# Altium schematic sheet LPC.SchDoc
size 320 x 228 mm; DocumentNumber: 2; SheetNumber: 2; SheetTotal: 5
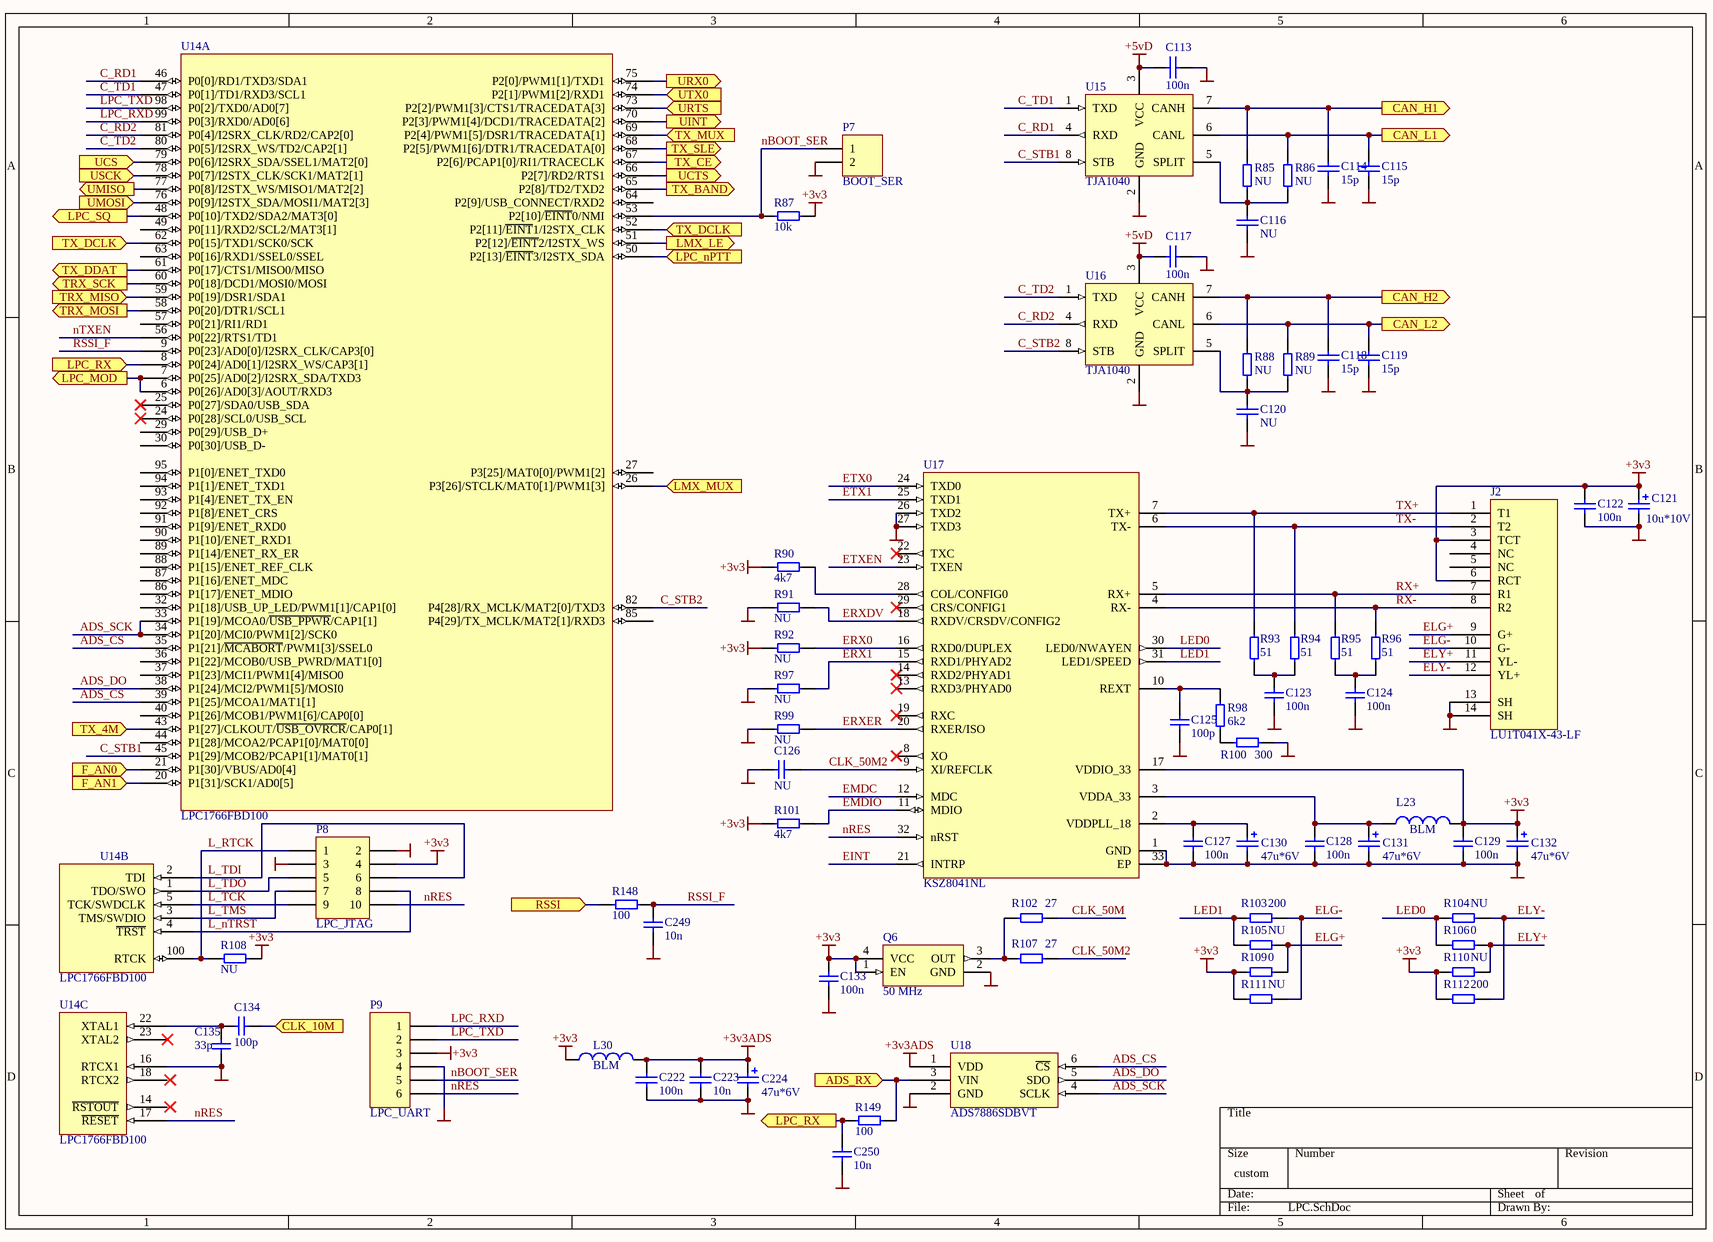
[diagram p0: LPC.SchDoc]

## Parts
C113  100n  [CAPC1608N]
C114  15p  [CAPC1608N]
C115  15p  [CAPC1608N]
C116  NU  [CAPC1608N]
C117  100n  [CAPC1608N]
C118  15p  [CAPC1608N]
C119  15p  [CAPC1608N]
C120  NU  [CAPC1608N]
C121  10u*10V  [Case_A]
C122  100n  [CAPC1608N]
C123  100n  [CAPC1608L]
C124  100n  [CAPC1608L]
C125  100p  [CAPC1608L]
C126  NU  [CAPC1608L]
C127  100n  [CAPC1608L]
C128  100n  [CAPC1608L]
C129  100n  [CAPC1608L]
C130  47u*6V  [Case_A]
C131  47u*6V  [Case_A]
C132  47u*6V  [Case_A]
C133  100n  [CAPC1608L]
C134  100p  [CAPC1608L]
C135  33p  [CAPC1608L]
C222  100n  [CAPC1608N]
C223  10n  [CAPC1608N]
C224  47u*6V  [Case_A]
C249  10n  [CAPC1608L]
C250  10n  [CAPC1608L]
J2  LU1T041X-43-LF  [JACK1.27-4H8C]
L23  BLM  [INDC2012L]
L30  BLM  [CAPC2012N]
P7  BOOT_SER  [HDR1X2]
P8  LPC_JTAG  [HDR2X5]
P9  LPC_UART  [HDR1X6]
Q6  50 MHz  [XTAL_7.5_5mm]
R85  NU  [RESC2012L]
R86  NU  [RESC2012L]
R87  10k  [RESC1608L]
R88  NU  [RESC2012L]
R89  NU  [RESC2012L]
R90  4k7  [RESC1608L]
R91  NU  [RESC1608L]
R92  NU  [RESC1608L]
R93  51  [RESC1608L]
R94  51  [RESC1608L]
R95  51  [RESC1608L]
R96  51  [RESC1608L]
R97  NU  [RESC1608L]
R98  6k2  [RESC1608L]
R99  NU  [RESC1608L]
R100  300  [RESC1608L]
R101  4k7  [RESC1608L]
R102  27  [RESC1608L]
R103  200  [RESC1608L]
R104  NU  [RESC1608L]
R105  NU  [RESC1608L]
R106  0  [RESC1608L]
R107  27  [RESC1608L]
R108  NU  [RESC1608L]
R109  0  [RESC1608L]
R110  NU  [RESC1608L]
R111  NU  [RESC1608L]
R112  200  [RESC1608L]
R148  100  [RESC1608L]
R149  100  [RESC1608L]
U14  LPC1766FBD100  [SOT407-1_L]  (parts A,B,C of 4)
U15  TJA1040  [SOIC-150-8]
U16  TJA1040  [SOIC-150-8]
U17  KSZ8041NL  [QFN50P500X500-32WAN]
U18  ADS7886SDBVT  [SOT26A-6N]

## Ports
ADS_RX (in), CAN_H1 (out), CAN_H2 (out), CAN_L1 (out), CAN_L2 (out), CLK_10M (in), F_AN0 (in), F_AN1 (in), LMX_LE (out), LMX_MUX (in), LPC_MOD (out), LPC_nPTT (in), LPC_RX (in), LPC_RX (out), LPC_SQ (out), RSSI (in), TRX_MISO (in), TRX_MOSI (out), TRX_SCK (out), TX_4M (in), TX_BAND (out), TX_CE (out), TX_DCLK (in), TX_DDAT (out), TX_MUX (in), TX_SLE (out), UCS (in), UCTS (out), UINT (out), UMISO (out), UMOSI (in), URTS (in), URX0 (out), USCK (in), UTX0 (in)

## Nets
+3v3: C121.1 C122.2 C129.2 C132.1 C133.2 J2.3(TCT) J2.6(RCT) L23.2 L30.1 P8.4 P9.3 Q6.1(EN) Q6.4(VCC) R87.2 R90.2 R92.2 R101.2 R108.1 R109.2 R110.2 R111.2 R112.2 U17.17(VDDIO_33)
+3v3ADS: C222.2 C223.2 C224.1 L30.2 U18.1(VDD)
+5vD: C113.1 C117.1 U15.3(VCC) U16.3(VCC)
GND: C113.2 C114.1 C115.1 C116.1 C117.2 C118.1 C119.1 C120.1 C121.2 C122.1 C123.1 C124.1 C125.1 C126.2 C127.1 C128.1 C129.1 C130.2 C131.2 C132.2 C133.1 C135.1 C222.1 C223.1 C224.2 C249.1 C250.1 J2.13(SH) J2.14(SH) P7.2 P8.2 P8.3 P9.4 Q6.2(GND) R91.2 R97.2 R99.2 R100.1 U14.16(RTCX1) U15.2(GND) U16.2(GND) U17.1(GND) U17.26(TXD2) U17.27(TXD3) U17.33(EP) U18.2(GND)
ADS_CS: U14.35(P1[21]/~{MCABORT}/PWM1[3]/SSEL0) U14.39(P1[25]/MCOA1/MAT1[1]) U18.6(~{CS})
ADS_DO: U14.38(P1[24]/MCI2/PWM1[5]/MOSI0) U18.5(SDO)
ADS_RX: R149.2 U18.3(VIN) ; port ADS_RX
ADS_SCK: U14.33(P1[19]/MCOA0/~{USB_PPWR}/CAP1[1]) U14.34(P1[20]/MCI0/PWM1[2]/SCK0) U18.4(SCLK)
C_RD1: U14.46(P0[0]/RD1/TXD3/SDA1) U15.4(RXD)
C_RD2: U14.81(P0[4]/I2SRX_CLK/RD2/CAP2[0]) U16.4(RXD)
C_STB1: U14.45(P1[29]/MCOB2/PCAP1[1]/MAT0[1]) U15.8(STB)
C_STB2: U14.82(P4[28]/RX_MCLK/MAT2[0]/TXD3) U16.8(STB)
C_TD1: U14.47(P0[1]/TD1/RXD3/SCL1) U15.1(TXD)
C_TD2: U14.80(P0[5]/I2SRX_WS/TD2/CAP2[1]) U16.1(TXD)
CAN_H1: C114.2 R85.1 U15.7(CANH) ; port CAN_H1
CAN_H2: C118.2 R88.1 U16.7(CANH) ; port CAN_H2
CAN_L1: C115.2 R86.1 U15.6(CANL) ; port CAN_L1
CAN_L2: C119.2 R89.1 U16.6(CANL) ; port CAN_L2
CLK_10M: C134.2 ; port CLK_10M
CLK_50M: R102.2
CLK_50M2: C126.1 R107.2 U17.9(XI/REFCLK)
EINT: U17.21(INTRP)
ELG+: J2.9(G+) R105.1 R109.1
ELG-: J2.10(G-) R103.1 R111.1
ELY+: J2.11(YL-) R106.1 R110.1
ELY-: J2.12(YL+) R104.1 R112.1
EMDC: U17.12(MDC)
EMDIO: R101.1 U17.11(MDIO)
ERX0: R92.1 U17.16(RXD0/DUPLEX)
ERX1: R97.1 U17.15(RXD1/PHYAD2)
ERXDV: R91.1 U17.18(RXDV/CRSDV/CONFIG2)
ERXER: R99.1 U17.20(RXER/ISO)
ETX0: U17.24(TXD0)
ETX1: U17.25(TXD1)
ETXEN: U17.23(TXEN)
F_AN0: U14.21(P1[30]/VBUS/AD0[4]) ; port F_AN0
F_AN1: U14.20(P1[31]/SCK1/AD0[5]) ; port F_AN1
L_nTRST: P8.8 U14.4(~{TRST})
L_RTCK: P8.1 R108.2 U14.100(RTCK)
L_TCK: P8.9 U14.5(TCK/SWDCLK)
L_TDI: P8.6 U14.2(TDI)
L_TDO: P8.5 U14.1(TDO/SWO)
L_TMS: P8.7 U14.3(TMS/SWDIO)
LED0: R104.2 R106.2 U17.30(LED0/NWAYEN)
LED1: R103.2 R105.2 U17.31(LED1/SPEED)
LMX_LE: U14.51(P2[12]/~{EINT}2/I2STX_WS) ; port LMX_LE
LMX_MUX: U14.26(P3[26]/STCLK/MAT0[1]/PWM1[3]) ; port LMX_MUX
LPC_MOD: U14.6(P0[26]/AD0[3]/AOUT/RXD3) U14.7(P0[25]/AD0[2]/I2SRX_SDA/TXD3) ; port LPC_MOD
LPC_nPTT: U14.50(P2[13]/~{EINT}3/I2STX_SDA) ; port LPC_nPTT
LPC_RX: C250.2 R149.1 U14.8(P0[24]/AD0[1]/I2SRX_WS/CAP3[1]) ; port LPC_RX
LPC_RXD: P9.1 U14.99(P0[3]/RXD0/AD0[6])
LPC_SQ: U14.48(P0[10]/TXD2/SDA2/MAT3[0]) ; port LPC_SQ
LPC_TXD: P9.2 U14.98(P0[2]/TXD0/AD0[7])
nBOOT_SER: P7.1 P9.5 R87.1 U14.53(P2[10]/~{EINT}0/NMI)
nRES: P8.10 P9.6 U14.17(~{RESET}) U17.32(nRST)
nTXEN: U14.56(P0[22]/RTS1/TD1)
RSSI: R148.1 ; port RSSI
RSSI_F: C249.2 R148.2 U14.9(P0[23]/AD0[0]/I2SRX_CLK/CAP3[0])
RX+: J2.7(R1) R95.2 U17.5(RX+)
RX-: J2.8(R2) R96.2 U17.4(RX-)
TRX_MISO: U14.59(P0[19]/DSR1/SDA1) ; port TRX_MISO
TRX_MOSI: U14.58(P0[20]/DTR1/SCL1) ; port TRX_MOSI
TRX_SCK: U14.60(P0[18]/DCD1/MOSI0/MOSI) ; port TRX_SCK
TX+: J2.1(T1) R93.2 U17.7(TX+)
TX-: J2.2(T2) R94.2 U17.6(TX-)
TX_4M: U14.43(P1[27]/CLKOUT/~{USB_OVRCR}/CAP0[1]) ; port TX_4M
TX_BAND: U14.65(P2[8]/TD2/TXD2) ; port TX_BAND
TX_CE: U14.67(P2[6]/PCAP1[0]/RI1/TRACECLK) ; port TX_CE
TX_DCLK: U14.52(P2[11]/~{EINT}1/I2STX_CLK) U14.62(P0[15]/TXD1/SCK0/SCK) ; port TX_DCLK
TX_DDAT: U14.61(P0[17]/CTS1/MISO0/MISO) ; port TX_DDAT
TX_MUX: U14.69(P2[4]/PWM1[5]/DSR1/TRACEDATA[1]) ; port TX_MUX
TX_SLE: U14.68(P2[5]/PWM1[6]/DTR1/TRACEDATA[0]) ; port TX_SLE
UCS: U14.79(P0[6]/I2SRX_SDA/SSEL1/MAT2[0]) ; port UCS
UCTS: U14.66(P2[7]/RD2/RTS1) ; port UCTS
UINT: U14.70(P2[3]/PWM1[4]/DCD1/TRACEDATA[2]) ; port UINT
UMISO: U14.77(P0[8]/I2STX_WS/MISO1/MAT2[2]) ; port UMISO
UMOSI: U14.76(P0[9]/I2STX_SDA/MOSI1/MAT2[3]) ; port UMOSI
URTS: U14.73(P2[2]/PWM1[3]/CTS1/TRACEDATA[3]) ; port URTS
URX0: U14.75(P2[0]/PWM1[1]/TXD1) ; port URX0
USCK: U14.78(P0[7]/I2STX_CLK/SCK1/MAT2[1]) ; port USCK
UTX0: U14.74(P2[1]/PWM1[2]/RXD1) ; port UTX0
NetC116_2: C116.2 R85.2 R86.2 U15.5(SPLIT)
NetC120_2: C120.2 R88.2 R89.2 U16.5(SPLIT)
NetC123_2: C123.2 R93.1 R94.1
NetC124_2: C124.2 R95.1 R96.1
NetC125_2: C125.2 R98.2 U17.10(REXT)
NetC127_2: C127.2 C130.1 U17.2(VDDPLL_18)
NetC128_2: C128.2 C131.1 L23.1 U17.3(VDDA_33)
NetC134_1: C134.1 C135.2 U14.22(XTAL1)
NetQ6_3: Q6.3(OUT) R102.1 R107.1
NetR90_1: R90.1 U17.28(COL/CONFIG0)
NetR98_1: R98.1 R100.2

Not connected (* = marked no-connect by the designer): J2 4(NC) 5(NC); U14 14(~{RSTOUT}) 18(RTCX2) 23(XTAL2)* 24(P0[28]/SCL0/USB_SCL)* 25(P0[27]/SDA0/USB_SDA)* 27(P3[25]/MAT0[0]/PWM1[2]) 29(P0[29]/USB_D+) 30(P0[30]/USB_D-) 32(P1[18]/USB_UP_LED/PWM1[1]/CAP1[0]) 36(P1[22]/MCOB0/USB_PWRD/MAT1[0]) 37(P1[23]/MCI1/PWM1[4]/MISO0) 40(P1[26]/MCOB1/PWM1[6]/CAP0[0]) 44(P1[28]/MCOA2/PCAP1[0]/MAT0[0]) 49(P0[11]/RXD2/SCL2/MAT3[1]) 57(P0[21]/RI1/RD1) 63(P0[16]/RXD1/SSEL0/SSEL) 64(P2[9]/USB_CONNECT/RXD2) 85(P4[29]/TX_MCLK/MAT2[1]/RXD3) 86(P1[17]/ENET_MDIO) 87(P1[16]/ENET_MDC) 88(P1[15]/ENET_REF_CLK) 89(P1[14]/ENET_RX_ER) 90(P1[10]/ENET_RXD1) 91(P1[9]/ENET_RXD0) 92(P1[8]/ENET_CRS) 93(P1[4]/ENET_TX_EN) 94(P1[1]/ENET_TXD1) 95(P1[0]/ENET_TXD0); U17 8(XO)* 13(RXD3/PHYAD0)* 14(RXD2/PHYAD1)* 19(RXC)* 22(TXC)* 29(CRS/CONFIG1)*

## Library data of the parts
C113-C120 C122-C129 C133-C135 C222 C223 C249 C250 = Cap: Capacitor; Value: 100pF; Published: 8-Jun-2000; LatestRevisionDate: 17-Jul-2002; LatestRevisionNote: Re-released for DXP Platform.; PackageReference: RAD-0.3; Publisher: Altium Limited
C121 C130-C132 C224 = Cap Pol: Polarized Capacitor (Surface Mount); Value: 100pF; Published: 8-Jun-2000; LatestRevisionDate: 17-Jul-2002; LatestRevisionNote: Re-released for DXP Platform.; PackageReference: C0805; Publisher: Altium Limited
J2 = LU1T516-43: Ethernet 10/100 jack with magnetics
L23 = INDUCTOR
L30 = Ferrite Bead: Code_IEC: 1005; Value: 10mH; Published: 8-Jun-2000; LatestRevisionDate: 17-Jul-2002; LatestRevisionNote: Re-released for DXP Platform.; PackageReference: 0402-A; Publisher: Altium Limited; Code_JEITA: 0402
P7 = Header 2: Header, 2-Pin; LatestRevisionDate: 17-Jul-2002; LatestRevisionNote: Re-released for DXP Platform.; Publisher: Altium Limited
P8 = Header 5X2: Header, 5-Pin, Dual row; LatestRevisionDate: 17-Jul-2002; LatestRevisionNote: Re-released for DXP Platform.; Publisher: Altium Limited
P9 = Header 6: Header, 6-Pin; LatestRevisionDate: 17-Jul-2002; LatestRevisionNote: Re-released for DXP Platform.; Publisher: Altium Limited
Q6 = XTAL_OSC: Crystal Oscillator
R85-R112 R148 R149 = Res: Resistor; Value: 1K; Published: 8-Jun-2000; LatestRevisionDate: 04-Mar-2005; LatestRevisionNote: PCB Footprint replaced.; PackageReference: J1-0603; Publisher: Altium Limited
U14 = LPC1766FBD100: ARM Cortex-M3 32-Bit Microcontroller, 512kB Flash,64kB SRAM w Ethernet,USB 2.0,Host/Device/OTG, CAN 100-Lead LQFP; Code_IEC: 136E20; Published: 17-Aug-2007; DatasheetVersion: rev.01, Jan-2007; PackageVersion: Feb-2003; PackageReference: SOT407-1; Publisher: Altium Limited; PackageDescription: 100-Pin Plastic Low Profile Quad Flat Pack, LQFP100; Code_JEDEC: MS-026; ComponentLink1Description: Manufacturer Link; ComponentLink1URL: http://www.nxp.com/; ComponentLink2Description: Datasheet; ComponentLink2URL: http://www.standardics.nxp.com/products/lpc2000/datasheet/lpc2364.lpc2366.lpc2368.pdf
U15 U16 = TJA1040: High-Speed CAN Tranceiver
U17 = KSZ8041: 10Base-T/100Base-TX Physical Layer Transceiver
U18 = ADS7886: 12-Bit, 1-MSPS, Micro-power ADC